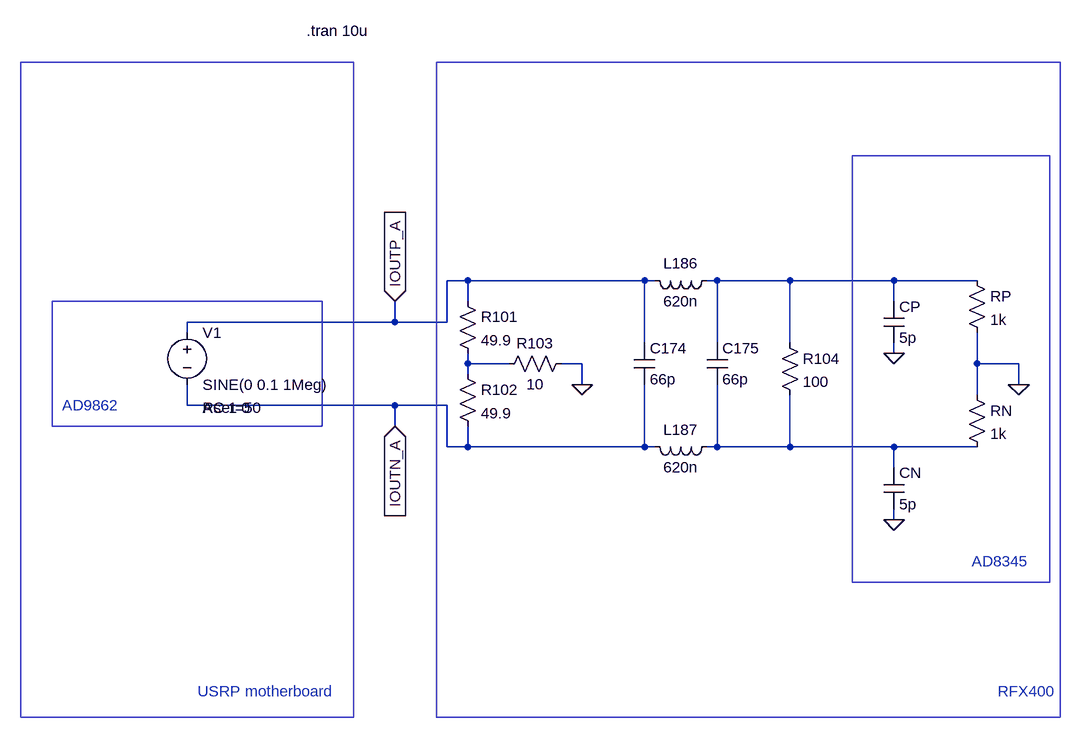
[diagram p0: schematic RFX400-AD8345-IN.asc]
RFX400-AD8345-IN.asc, the LTspice schematic file:
Version 4
SHEET 1 1508 724
WIRE -624 48 -656 48
WIRE -352 48 -624 48
WIRE -336 48 -352 48
WIRE -240 48 -256 48
WIRE -128 48 -240 48
WIRE 32 48 -128 48
WIRE 160 48 32 48
WIRE -624 80 -624 48
WIRE 32 80 32 48
WIRE -736 112 -736 80
WIRE -736 112 -1056 112
WIRE -656 112 -656 48
WIRE -656 112 -736 112
WIRE -1056 128 -1056 112
WIRE -352 144 -352 48
WIRE -240 144 -240 48
WIRE -128 144 -128 48
WIRE 32 160 32 144
WIRE -624 176 -624 160
WIRE -560 176 -624 176
WIRE -448 176 -480 176
WIRE 160 176 160 128
WIRE 224 176 160 176
WIRE -624 192 -624 176
WIRE -448 208 -448 176
WIRE 224 208 224 176
WIRE 160 224 160 176
WIRE -1056 240 -1056 208
WIRE -736 240 -1056 240
WIRE -656 240 -736 240
WIRE -736 272 -736 240
WIRE -656 304 -656 240
WIRE -624 304 -624 272
WIRE -624 304 -656 304
WIRE -352 304 -352 208
WIRE -352 304 -624 304
WIRE -336 304 -352 304
WIRE -240 304 -240 208
WIRE -240 304 -256 304
WIRE -128 304 -128 224
WIRE -128 304 -240 304
WIRE 32 304 -128 304
WIRE 160 304 32 304
WIRE 32 336 32 304
WIRE 32 416 32 400
FLAG -736 80 IOUTP_A
IOPIN -736 80 In
FLAG -736 272 IOUTN_A
IOPIN -736 272 In
FLAG -448 208 0
FLAG 224 208 0
FLAG 32 160 0
FLAG 32 416 0
SYMBOL voltage -1056 112 R0
WINDOW 123 24 132 Left 0
WINDOW 39 24 132 Left 0
SYMATTR Value2 AC 1 0
SYMATTR SpiceLine Rser=50
SYMATTR InstName V1
SYMATTR Value SINE(0 0.1 1Meg)
SYMBOL res -640 64 R0
SYMATTR InstName R101
SYMATTR Value 49.9
SYMATTR SpiceLine tol=1 pwr=0.1
SYMBOL res -640 176 R0
SYMATTR InstName R102
SYMATTR Value 49.9
SYMATTR SpiceLine tol=1 pwr=0.1
SYMBOL res -464 160 R90
WINDOW 0 0 56 VBottom 0
WINDOW 3 32 56 VTop 0
SYMATTR InstName R103
SYMATTR Value 10
SYMATTR SpiceLine tol=1 pwr=0.1
SYMBOL cap -368 144 R0
SYMATTR InstName C174
SYMATTR Value 66p
SYMBOL cap -256 144 R0
SYMATTR InstName C175
SYMATTR Value 66p
SYMBOL ind -240 32 R90
WINDOW 0 5 56 VBottom 0
WINDOW 3 32 56 VTop 0
SYMATTR InstName L186
SYMATTR Value 620n
SYMBOL ind -240 288 R90
WINDOW 0 5 56 VBottom 0
WINDOW 3 32 56 VTop 0
SYMATTR InstName L187
SYMATTR Value 620n
SYMBOL res -144 128 R0
SYMATTR InstName R104
SYMATTR Value 100
SYMATTR SpiceLine tol=1 pwr=0.1
SYMBOL cap 16 80 R0
SYMATTR InstName CP
SYMATTR Value 5p
SYMBOL cap 16 336 R0
SYMATTR InstName CN
SYMATTR Value 5p
SYMBOL res 144 32 R0
SYMATTR InstName RP
SYMATTR Value 1k
SYMBOL res 144 208 R0
SYMATTR InstName RN
SYMATTR Value 1k
TEXT -872 -336 Left 0 !.tran 10u
TEXT -1248 240 Left 0 ;AD9862
TEXT 152 480 Left 0 ;AD8345
TEXT 192 680 Left 0 ;RFX400
TEXT -1040 680 Left 0 ;USRP motherboard
RECTANGLE Normal -1264 272 -848 80
RECTANGLE Normal 272 512 -32 -144
RECTANGLE Normal -672 720 288 -288
RECTANGLE Normal -1312 720 -800 -288

The netlist it stands for:
* RFX400-AD8345-IN.asc
V1 IOUTP_A IOUTN_A SINE(0 0.1 1Meg) AC 1 0 Rser=50
R101 IOUTP_A N002 49.9 tol=1 pwr=0.1
R102 N002 IOUTN_A 49.9 tol=1 pwr=0.1
R103 0 N002 10 tol=1 pwr=0.1
C174 IOUTP_A IOUTN_A 66p
C175 N001 N003 66p
L186 N001 IOUTP_A 620n
L187 N003 IOUTN_A 620n
R104 N001 N003 100 tol=1 pwr=0.1
CP N001 0 5p
CN N003 0 5p
RP N001 0 1k
RN 0 N003 1k
.tran 10u
* AD9862
* AD8345
* RFX400
* USRP motherboard
.backanno
.end